# Altium schematic sheet Bat 20Vvoeding.SchDoc
size A4; SheetNumber: 5; SheetTotal: 5
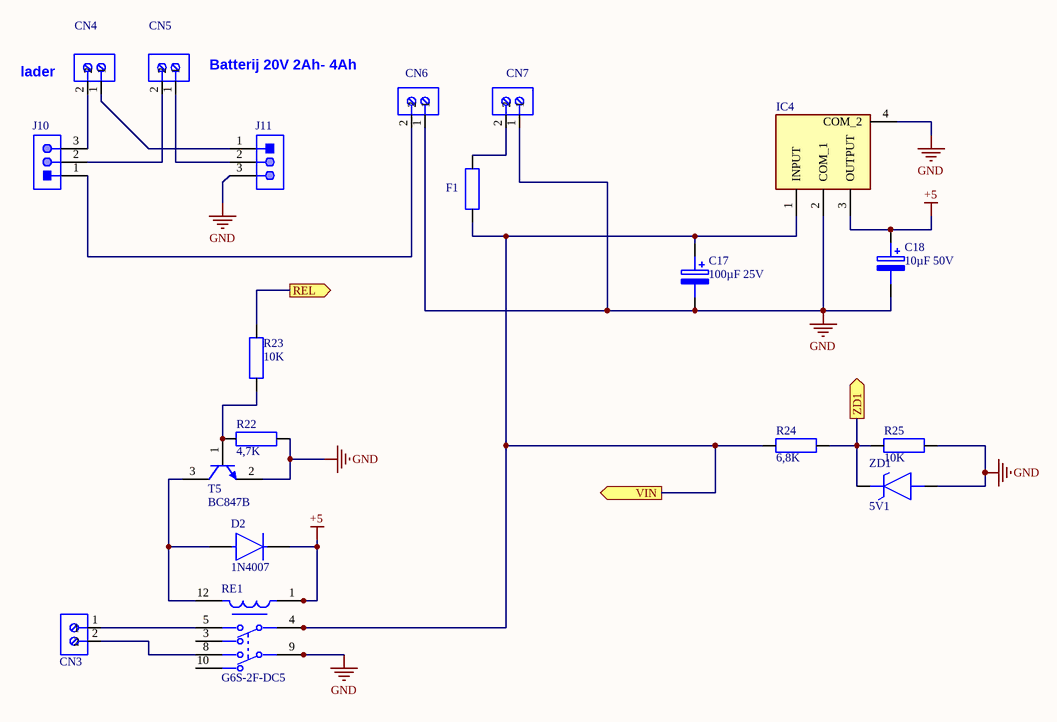
[diagram p0: Bat 20Vvoeding.SchDoc]

## Parts
C17  100µF 25V  [caprad100mil]
C18  10µF 50V  [caprad100mil]
CN3  282836-2  [cnn2pin]  (value not drawn)
CN4  282836-2  [cnn2pin]  (value not drawn)
CN5  282836-2  [cnn2pin]  (value not drawn)
CN6  282836-2  [cnn2pin]  (value not drawn)
CN7  282836-2  [cnn2pin]  (value not drawn)
D2  1N4007  [FP-1N4007-MFG]
F1  4,7K  [Fuze]  (value not drawn)
IC4  TL780-05CKTTR  [TL78005CKTTR]  (value not drawn)
J10  (no value)  [3pinsheader]
J11  (no value)  [3pinsheader]
R22  4,7K  [res0805ph]
R23  10K  [res0805ph]
R24  6,8K  [res0805ph]
R25  10K  [res0805ph]
RE1  G6S-2F-DC5  [FP-G6S-2F-DC5-MFG]
T5  BC847B  [sot23]
ZD1  5V1  [DIOAD1068W53L380D172]

## Ports
REL (out), VIN (out), ZD1 (out)

## Nets
+5: C18.1(+) D2.1(C) IC4.3(OUTPUT) RE1.1
GND: C17.2(-) C18.2(-) CN6.1 CN7.1 IC4.2(COM_1) IC4.4(COM_2) J11.3 R22.2 R25.1 RE1.9 T5.2(E) ZD1.2(A)
REL: R23.2 ; port REL
VIN: C17.1(+) F1.1 IC4.1(INPUT) R24.1 RE1.4 ; port VIN
ZD1: R24.2 R25.2 ZD1.1(K) ; port ZD1
NetCN3_1: CN3.1 RE1.5
NetCN3_2: CN3.2 RE1.8
NetCN4_1: CN4.1 J11.1
NetCN4_2: CN4.2 J10.3
NetCN5_1: CN5.1 J11.2
NetCN5_2: CN5.2 J10.2
NetCN6_2: CN6.2 J10.1
NetCN7_2: CN7.2 F1.2
NetD2_2: D2.2(A) RE1.12 T5.3(C)
NetR22_1: R22.1 R23.1 T5.1(B)

Not connected (* = marked no-connect by the designer): RE1 3 10

## Notes on the sheet
- (near CN4) lader
- (near CN5) Batterij 20V 2Ah- 4Ah

## Library data of the parts
C17 C18 = ELCO220uF: Capacitor Polarised; Manufacturer_Name: Kemet; Manufacturer_Part_Number: T494D227K006AT; Datasheet Link: https://datasheet.datasheetarchive.com/originals/distributors/Datasheets-DGA21/1893029.pdf; Height: 3.1mm; Mouser Part Number: 80-T494D227K006; Mouser Price/Stock: https://www.mouser.co.uk/ProductDetail/KEMET/T494D227K006AT/?qs=KZyWKl2lJVCDSHmnBye8LQ%3D%3D
CN3-CN7 = CNN2P: Female Header, Pitch 5 mm, 1 x 2 Position, Height 10 mm, Tail Length 3.5 mm, Rohs, Bulk; Manufacturer: TE Connectivity; Wire Gauge: 16-30AWG; Product Training Modules: Wire-to-BoardEurostyleTerminalBlocks; Clamp Material - Plating: Brass-NickelPlated; Voltage: 300V; Mating Orientation: HorizontalwithBoard; Current: 13.5A; Pitch: 0.197"(5.00mm); Screw Thread: M3; 3D Model: 282836-2.pdf; Other Names: 5ULV-02B / A98076; Dynamic Catalog: BuchananSeries; Number of Levels: 1; Torque - Screw: 0.68Nm(6Lb-In); Featured Product: EurostyleTerminalBlockConnectors; Positions Per Level: 2; Wire Termination: Screw-RisingCageClamp; Datasheet URL: http://www.te.com.cn/commerce/DocumentDelivery/DDEController?Action=showdoc&DocId=Catalog+Section%7F1308389_EUROSTYLE_TERMINAL_BLOCKS%7F0607%7Fpdf%7FEnglish%7FENG_CS_1308389_EUROSTYLE_TERMINAL_BLOCKS_0607.pdf%7F282836-2; Color: Green; Family: TerminalBlocks-WiretoBoard; RoHS Information: 282836-2StatementofCompliance; Standard Package: 300; Contact Material - Plating: Brass-TinPlated; Manufacturer URL: http://www.te.com; Housing Material: Polyamide(PA66),Nylon6/6; Features: Interlocking(Side); Package Description: Female Header, Pitch 5 mm, 1 x 2 Position, Height 10 mm, Tail Length 3.5 mm; Mounting Type: ThroughHole; Package Reference: THD; Packaging: Bulk; Series: Buchanan; Category: Connectors,Interconnects; Screw Material - Plating: Brass-NickelPlated
D2 = CMP-123542-000001-1: Rectifier diode 1000 V 1 A DO-41, ,; Manufacturer: Diotec; Max Surge Forward Current: 27A; Forward Current: 1A; Max Junction Temp: +175°C; Reverse Voltage: 1000V; Value: 15pF; Peak Reverse Current: 5uA; Category: Diode; Temperature Range Low: -50°C; Automotive: No; Temperature: -50°C to +175°C; Lead Free: Yes; ComponentLink2Description: Datasheet; Max Repetitive Reverse Voltage: 1000V; ComponentLink2URL: https://datasheet.octopart.com/1N4007-Diotec-datasheet-62346875.pdf; Manufacturer Part Number: 1N4007; Device Class L3: Rectifier Diodes; Height: 2.8mm; Octopart: https://octopart.com/1n4007-diotec-4040411; Package: 1N4007; Temperature Range High: +175°C; Device Class L1: Discrete Semiconductors; Device Class L2: Diodes; RoHS: TRUE; Capacitance: 15pF; Ipc Land Pattern Name: DIOAD888W100L520D280
F1 = Fuze: Resistor; Manufacturer_Name: TE Connectivity; Manufacturer_Part_Number: CPF0201D10K2C1; Datasheet Link: http://www.te.com/commerce/DocumentDelivery/DDEController?Action=showdoc&DocId=Data+Sheet%7F1773200-1%7FA%7Fpdf%7FEnglish%7FENG_DS_1773200-1_A.pdf%7F4-2176215-6; Height: 0.28mm; Mouser Part Number: N/A; Mouser Price/Stock: https://www.mouser.com/Search/Refine.aspx?Keyword=N%2FA
IC4 = TL780-05CKTTR: Integrated Circuit; Manufacturer_Name: Texas Instruments; Datasheet Link: http://www.ti.com/general/docs/suppproductinfo.tsp?distId=26&gotoUrl=http%3A%2F%2Fwww.ti.com%2Flit%2Fgpn%2Ftl780; Height: 5.08mm; Manufacturer_Part_Number: TL780-05CKTTR
J10 J11 = header3pin: THT Vertical Pin Header WR-PHD, Pitch 2.54 mm, Single Row, 2 pins; Manufacturer: Wurth Elektronik; Part Number: 61300211121; Manufacturer: Wurth Electronics; Rated Current: 3A; Gender: Male; Withstanding Voltage: 500VAC; Working Voltage: 250VAC; Pitch: 2.54mm; Contact Resistance: 20mOhm; Pin Number: 2; Mounting Technology: THT; Orientation: Vertical; Operating Temperature: -40to105degC; Packaging: Bag; Publisher: WurthElektronik; Datasheet URL: https://katalog.we-online.de/em/datasheet/6130xx11121.pdf; Manufacturer URL: http://www.we-online.de; Row Number: Single; Package Reference: 61300211121; Manufacturer Part Number: 61300211121
R22-R25 = Res: Resistor; Manufacturer_Name: TE Connectivity; Manufacturer_Part_Number: CPF0201D10K2C1; Datasheet Link: http://www.te.com/commerce/DocumentDelivery/DDEController?Action=showdoc&DocId=Data+Sheet%7F1773200-1%7FA%7Fpdf%7FEnglish%7FENG_DS_1773200-1_A.pdf%7F4-2176215-6; Height: 0.28mm; Mouser Part Number: N/A; Mouser Price/Stock: https://www.mouser.com/Search/Refine.aspx?Keyword=N%2FA
RE1 = CMP-08823-000012-1: RELAY TELECOM DPDT 2A 5VDC; Manufacturer: Omron; Coil Resistance: 178Ω; Coil Current: 28.1mA; Coil Voltage: 5V; Standoff Height: 0.35mm; Coil Power: 140mW; Coil Type: Non-Latching; Number Of Contacts: 2; RoHS: TRUE; Device Class L3: Signal Relays; Ambient Temperature Range Low: -40°C; Switching Current: 2A; Device Class L1: Electromechanical; Lead Free: Yes; Category: Relay; Digikey Description: RELAY TELECOM DPDT 2A 5VDC; Height: 9.4mm; Temperature: -40°C to +85°C; Throw Configuration: DPDT; Octopart: https://octopart.com/g6s-2f-dc5-omron-85236; Package: G6S-2F-DC5; Temperature Range High: +85°C; Automotive: No; Current Rating: 2A; Manufacturer Part Number: G6S-2F-DC5; Mouser Description: Electromechanical Relay 5VDC 178Ohm 2A DPDT (14.8x9.2x9.2)mm SMD Signal Relay; Temperature Range Low: -40°C; Device Class L2: Relays; Ambient Temperature Range High: +85°C; ComponentLink2URL: https://omronfs.omron.com/en_US/ecb/products/pdf/en-g6s.pdf; ComponentLink2Description: Datasheet
T5 = BC847: NPN Silicon AF Transistor, 45 V VCEO, 100 mA IC, SOT23, Reel, Green; Manufacturer: Infineon; VEBO (max): 6Â V; ICBO (max): 15Â nA; VCBO (max): 50Â V; IBM (max): 200Â mA; Green: TRUE; Ptot (max): 330Â mW; fT (typ): 250Â MHz; IC (max): 100Â mA; VCEO (max): 45Â V; PackageDescription: 3-Pin Small Outline Transistor Package, 1.3 x 2.9 mm Body, 0.95 mm Pitch; ComponentLink3URL: http://www.infineon.com/dgdl/SOT23-Package_Overview.pdf?folderId=db3a30431936bc4b0119532290053c66&fileId=db3a30431936bc4b0119533468123c85; PackageVersion: Apr-08; Packing: Reel; ComponentLink3Description: Package Specification; ComponentLink2URL: http://www.infineon.com/dgdl/bc847series_bc848series_bc849series_bc850series.pdf?folderId=db3a304314dca389011541d30fa21656&fileId=db3a304314dca389011541d4630a1657; ComponentLink1URL: http://www.infineon.com/; ComponentLink2Description: Datasheet; Polarity: NPN; Mounting Technology: Surface Mount; PackageReference: SOT23; ICM (max): 200Â mA; ComponentLink1Description: Manufacturer URL; PartNumber: BC847B
ZD1 = BZX79C3V3: Zener Diode; Manufacturer_Name: ON Semiconductor; Manufacturer_Part_Number: BZX79C6V8; Datasheet Link: https://www.onsemi.com/pub/Collateral/BZX79C2V4-D.PDF; Mouser Part Number: 512-BZX79C6V8; Mouser Price/Stock: https://www.mouser.co.uk/ProductDetail/ON-Semiconductor-Fairchild/BZX79C6V8?qs=G5AQjGfRJcK7HFctFTHqog%3D%3D; Arrow Part Number: BZX79C6V8; Arrow Price/Stock: https://www.arrow.com/en/products/bzx79c6v8/on-semiconductor